# Altium schematic sheet SP26_FindingTitan_PWr & GND_Michael_Krueger.SchDoc
size A; SheetNumber: 1; SheetTotal: 6
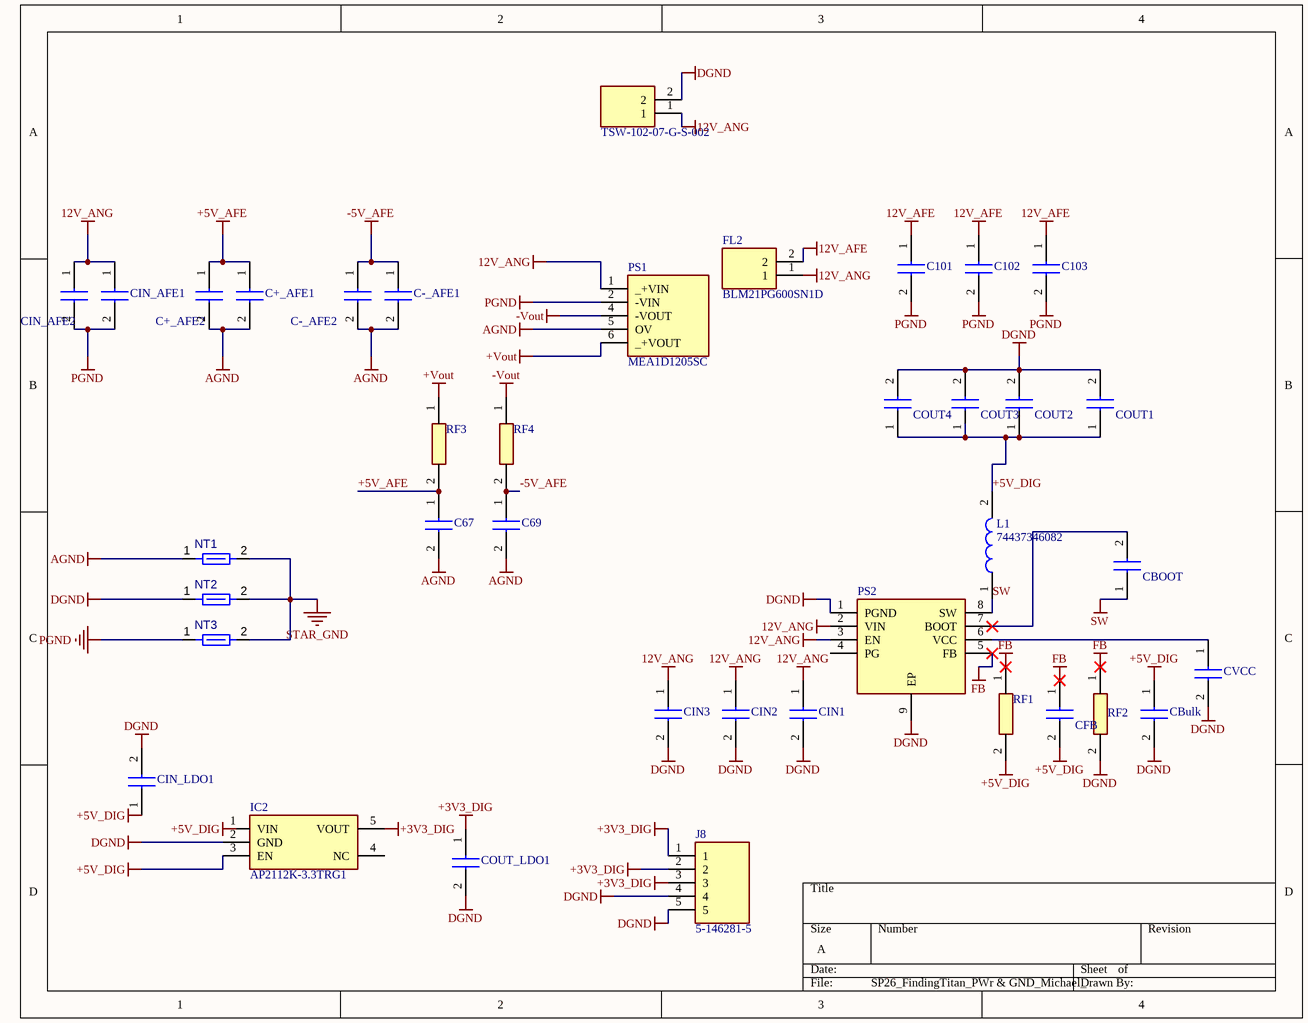
[diagram p0: SP26_FindingTitan_PWr & GND_Michael_Krueger.SchDoc]

## Parts
C67  GRM21BR71H105KA12L  [CAPC2012X145N]  (value not drawn)
C69  GRM21BR71H105KA12L  [CAPC2012X145N]  (value not drawn)
C101  GRM21BR71H104KA01L  [CAPC2012X145N]  (value not drawn)
C102  CL10B224KB8NNNC  [CAPC1608X90N]  (value not drawn)
C103  GRM32ER71H106KA12L  [CAPC3225X270N]  (value not drawn)
C+_AFE1  C1206C104K4RACTU  [C1206]  (value not drawn)
C+_AFE2  C3216X7R1H106K160AC  [CAPC3216X180N]  (value not drawn)
C-_AFE1  C1206C104K4RACTU  [C1206]  (value not drawn)
C-_AFE2  C3216X7R1H106K160AC  [CAPC3216X180N]  (value not drawn)
CBOOT  GRM188R71H104KA93D  [CAPC1608X90N]  (value not drawn)
CBulk  CL21A476MQYNNNE  [CAPC2012X135N]  (value not drawn)
CFB  GRM1555C1H220JA01D  [CAPC1005X70N]  (value not drawn)
CIN1  GRM32ER71H106KA12L  [CAPC3225X270N]  (value not drawn)
CIN2  CL10B224KB8NNNC  [CAPC1608X90N]  (value not drawn)
CIN3  GRM21BR71H104KA01L  [CAPC2012X145N]  (value not drawn)
CIN_AFE1  C1206C104K4RACTU  [C1206]  (value not drawn)
CIN_AFE2  C3216X7R1H106K160AC  [CAPC3216X180N]  (value not drawn)
CIN_LDO1  GRM31CR71A475KA01L  [CAPC3216X180N]  (value not drawn)
COUT1  GRM21BR61A226ME44K  [GRM21BR60J226ME39L]  (value not drawn)
COUT2  GRM21BR61A226ME44K  [GRM21BR60J226ME39L]  (value not drawn)
COUT3  GRM21BR61A226ME44K  [GRM21BR60J226ME39L]  (value not drawn)
COUT4  GRM21BR61A226ME44K  [GRM21BR60J226ME39L]  (value not drawn)
COUT_LDO1  GRM31CR71A475KA01L  [CAPC3216X180N]  (value not drawn)
CVCC  GRM188R61A105KA61D  [CAPC1608X90N]  (value not drawn)
FL2  BLM21PG600SN1D  [BLM21AG102BH1J]
IC2  AP2112K-3.3TRG1  [SOT95P285X140-5N]
J8  5-146281-5  [HDRV5W67P0X254_1X5_1229X234X821P]
J?  TSW-102-07-G-S-002  [HDRV2W64P0X254_1X2_508X254X838P]
L1  74437346082  [WE-LHMI_7030/705048]
NT1  Net Tie 0.6x1.4mm  [SHORT10_8MIL-FP]  (value not drawn)  (net tie, no BOM)
NT2  Net Tie 0.6x1.4mm  [SHORT10_8MIL-FP]  (value not drawn)  (net tie, no BOM)
NT3  Net Tie 0.6x1.4mm  [SHORT10_8MIL-FP]  (value not drawn)  (net tie, no BOM)
PS1  MEA1D1205SC  [MEA1D1205SC]
PS2  LMR33630ADDA  [SOIC127P600X170-9N]  (value not drawn)
RF1  CRCW0805100KFKEAHP  [RESC2012X60N]  (value not drawn)
RF2  CRCW080524K9FKEA  [RESC2012X50N]  (value not drawn)
RF3  CRCW0805100KFKEAHP  [RESC2012X60N]  (value not drawn)
RF4  CRCW0805100KFKEAHP  [RESC2012X60N]  (value not drawn)

## Nets
12V_AFE: C101.1 C102.1 C103.1 FL2.2
12V_ANG: CIN1.1 CIN2.1 CIN3.1 CIN_AFE1.1 CIN_AFE2.1 FL2.1 J?.1 PS1.1(_+VIN) PS2.2(VIN) PS2.3(EN)
+3V3_DIG: COUT_LDO1.1 IC2.5(VOUT) J8.1 J8.2 J8.3
+5V_AFE: C67.1 C+_AFE1.1 C+_AFE2.1 RF3.2
+5V_DIG: CBulk.1 CFB.2 CIN_LDO1.1 COUT1.1 COUT2.1 COUT3.1 COUT4.1 IC2.3(EN) L1.2 RF1.2
+Vout: PS1.6(_+VOUT) RF3.1
-5V_AFE: C69.1 C-_AFE1.1 C-_AFE2.1 RF4.2
-Vout: PS1.4(-VOUT) RF4.1
AGND: C67.2 C69.2 C+_AFE1.2 C+_AFE2.2 C-_AFE1.2 C-_AFE2.2 NT1.1 PS1.5(OV)
DGND: CBulk.2 CIN1.2 CIN2.2 CIN3.2 CIN_LDO1.2 COUT1.2 COUT2.2 COUT3.2 COUT4.2 COUT_LDO1.2 CVCC.2 IC2.2(GND) J8.4 J8.5 J?.2 NT2.1 PS2.1(PGND) PS2.9(EP) RF2.2
FB: CFB.1 PS2.5(FB) RF1.1 RF2.1
PGND: C101.2 C102.2 C103.2 CIN_AFE1.2 CIN_AFE2.2 NT3.1 PS1.2(-VIN)
STAR_GND: NT1.2 NT2.2 NT3.2
SW: CBOOT.1 L1.1 PS2.8(SW)
NetCBOOT_2: CBOOT.2 PS2.7(BOOT)
NetCVCC_1: CVCC.1 PS2.6(VCC)

Not connected (* = marked no-connect by the designer): IC2 1(VIN) 4(NC); PS2 4(PG)

## Notes on the sheet
- Labels drawn without touching a wire or pin: +5V_DIG

## Library data of the parts
C67 C69 = GRM21BR71H105KA12L: Capacitor; Manufacturer_Name: Murata Electronics; Datasheet Link: https://search.murata.co.jp/Ceramy/image/img/A01X/G101/ENG/GRM21BR71H105KA12-01.pdf; Height: 1.45mm; Manufacturer_Part_Number: GRM21BR71H105KA12L; Mouser Part Number: 81-GRM21BR71H105KA2L; Mouser Price/Stock: https://www.mouser.co.uk/ProductDetail/Murata-Electronics/GRM21BR71H105KA12L?qs=Er06SXQpt%252B60EIT%2FJ7%2F41Q%3D%3D; Arrow Part Number: GRM21BR71H105KA12L; Arrow Price/Stock: https://www.arrow.com/en/products/grm21br71h105ka12l/murata-manufacturing?utm_currency=USD&region=europe
C101 CIN3 = GRM21BR71H104KA01L: Capacitor; Manufacturer_Name: Murata Electronics; Datasheet Link: https://search.murata.co.jp/Ceramy/image/img/A01X/G101/ENG/GRM21BR71H104KA01-01.pdf; Height: 1.45mm; Manufacturer_Part_Number: GRM21BR71H104KA01L; Mouser Part Number: 81-GRM40X104K50L; Mouser Price/Stock: https://www.mouser.co.uk/ProductDetail/Murata-Electronics/GRM21BR71H104KA01L?qs=JovLnzPPZAL81o2XNDa%2FDA%3D%3D; Arrow Part Number: GRM21BR71H104KA01L; Arrow Price/Stock: https://www.arrow.com/en/products/grm21br71h104ka01l/murata-manufacturing?utm_currency=USD&region=europe
C102 CIN2 = CL10B224KB8NNNC: Capacitor; Manufacturer_Name: SAMSUNG; Datasheet Link: https://datasheet.pas.partquest.com/images/VipMasterIC/IC/SEMS/SEMS-S-A0008520096/SEMS-S-A0008520031-1.pdf?hkey=EF798316E3902B6ED9A73243A3159BB0; Height: 0.9mm; Manufacturer_Part_Number: CL10B224KB8NNNC; Mouser Part Number: 187-CL10B224KB8NNNC; Mouser Price/Stock: https://www.mouser.co.uk/ProductDetail/Samsung-Electro-Mechanics/CL10B224KB8NNNC?qs=wk8hpYEhAtJXV8UU0vulXQ%3D%3D; Arrow Part Number: CL10B224KB8NNNC; Arrow Price/Stock: https://www.arrow.com/en/products/cl10b224kb8nnnc/samsung-electro-mechanics
C103 CIN1 = GRM32ER71H106KA12L: Capacitor; Manufacturer_Name: Murata Electronics; Datasheet Link: https://pim.murata.com/asset/pim4/ceramicCapacitorSMD/SMD-EN_PDF_CERAMICCAPACITORSMD; Height: 2.7mm; Manufacturer_Part_Number: GRM32ER71H106KA12L; Mouser Part Number: 81-GRM32ER71H106KA2L; Mouser Price/Stock: https://www.mouser.co.uk/ProductDetail/Murata-Electronics/GRM32ER71H106KA12L?qs=6pxx44s1bjkjdm74o%2FrKhg%3D%3D; Arrow Part Number: GRM32ER71H106KA12L; Arrow Price/Stock: https://www.arrow.com/en/products/grm32er71h106ka12l/murata-manufacturing?utm_currency=USD&region=europe
C+_AFE1 C-_AFE1 CIN_AFE1 = C1206C104K4RACTU: Capacitor; Manufacturer_Name: KEMET; Datasheet Link: https://content.kemet.com/datasheets/KEM_C1002_X7R_SMD.pdf; Manufacturer_Part_Number: C1206C104K4RACTU; Mouser Part Number: 80-C1206C104K4R; Mouser Price/Stock: https://www.mouser.co.uk/ProductDetail/KEMET/C1206C104K4RACTU?qs=NAOyRStS94fKvqJx0gg6JQ%3D%3D; Arrow Part Number: C1206C104K4RACTU; Arrow Price/Stock: https://www.arrow.com/en/products/c1206c104k4ractu/kemet-corporation
C+_AFE2 C-_AFE2 CIN_AFE2 = C3216X7R1H106K160AC: Capacitor; Manufacturer_Name: TDK; Datasheet Link: https://product.tdk.com/info/en/catalog/datasheets/mlcc_commercial_midvoltage_en.pdf; Height: 1.8mm; Manufacturer_Part_Number: C3216X7R1H106K160AC; Mouser Part Number: 810-C3216X7R1HK160AC; Mouser Price/Stock: https://www.mouser.co.uk/ProductDetail/TDK/C3216X7R1H106K160AC?qs=gZXFycFWdAOhQ%2F%252B4feavtA%3D%3D; Arrow Part Number: C3216X7R1H106K160AC; Arrow Price/Stock: https://www.arrow.com/en/products/c3216x7r1h106k160ac/tdk?utm_currency=USD&region=europe
CBOOT = GRM188R71H104KA93D: Capacitor; Manufacturer_Name: Murata Electronics; Datasheet Link: https://datasheet.datasheetarchive.com/originals/distributors/Datasheets_SAMA/ec4f1577dddcc7a13ddad897a28002d3.pdf; Height: 0.9mm; Manufacturer_Part_Number: GRM188R71H104KA93D; Mouser Part Number: 81-GRM39X104K50D; Mouser Price/Stock: https://www.mouser.co.uk/ProductDetail/Murata-Electronics/GRM188R71H104KA93D?qs=f7ZljCwbPOm85Y6l%2FNGt7A%3D%3D; Arrow Part Number: GRM188R71H104KA93D; Arrow Price/Stock: https://www.arrow.com/en/products/grm188r71h104ka93d/murata-manufacturing?utm_currency=USD&region=europe
CBulk = CL21A476MQYNNNE: Capacitor; Manufacturer_Name: SAMSUNG; Datasheet Link: https://media.digikey.com/pdf/Data%20Sheets/Samsung%20PDFs/CL_Series_MLCC_ds.pdf; Height: 1.35mm; Manufacturer_Part_Number: CL21A476MQYNNNE; Mouser Part Number: 187-CL21A476MQYNNNE; Mouser Price/Stock: https://www.mouser.co.uk/ProductDetail/Samsung-Electro-Mechanics/CL21A476MQYNNNE?qs=yOVawPpwOwkBQMdcEdF9JA%3D%3D; Arrow Part Number: CL21A476MQYNNNE; Arrow Price/Stock: https://www.arrow.com/en/products/cl21a476mqynnne/samsung-electro-mechanics?region=nac
CFB = GRM1555C1H220JA01D: Capacitor; Manufacturer_Name: Murata Electronics; Datasheet Link: https://search.murata.co.jp/Ceramy/image/img/A01X/G101/ENG/GRM1555C1H220JA01-01A.pdf; Height: 0.7mm; Manufacturer_Part_Number: GRM1555C1H220JA01D; Mouser Part Number: 81-GRM1555C1H220JA1D; Mouser Price/Stock: https://www.mouser.co.uk/ProductDetail/Murata-Electronics/GRM1555C1H220JA01D?qs=4k9rjS6ZRl6sPwaL%252BE1uDQ%3D%3D; Arrow Part Number: GRM1555C1H220JA01D; Arrow Price/Stock: https://www.arrow.com/en/products/grm1555c1h220ja01d/murata-manufacturing?utm_currency=USD&region=nac
CIN_LDO1 COUT_LDO1 = GRM31CR71A475KA01L: Capacitor; Manufacturer_Name: Murata Electronics; Datasheet Link: https://search.murata.co.jp/Ceramy/image/img/A01X/G101/ENG/GRM31CR71A475KA01-01.pdf; Height: 1.8mm; Manufacturer_Part_Number: GRM31CR71A475KA01L; Mouser Part Number: 81-GRM426X475K10L; Mouser Price/Stock: https://www.mouser.com/Search/Refine.aspx?Keyword=81-GRM426X475K10L; Arrow Part Number: GRM31CR71A475KA01L; Arrow Price/Stock: https://www.arrow.com/en/products/grm31cr71a475ka01l/murata-manufacturing
COUT1-COUT4 = GRM21BR61A226ME44K: Capacitor; Manufacturer_Name: Murata Electronics; Datasheet Link: https://search.murata.co.jp/Ceramy/image/img/A01X/G101/ENG/GRM21BR61A226ME44-01A.pdf; Height: 1.45mm; Manufacturer_Part_Number: GRM21BR61A226ME44K; Mouser Part Number: 81-GRM21BR61A226ME4K; Mouser Price/Stock: https://www.mouser.co.uk/ProductDetail/Murata-Electronics/GRM21BR61A226ME44K?qs=hNud%2FORuBR0Fst3clGMQAg%3D%3D
CVCC = GRM188R61A105KA61D: Capacitor; Manufacturer_Name: Murata Electronics; Datasheet Link: https://search.murata.co.jp/Ceramy/image/img/A01X/G101/ENG/GRM188R61A105KA61-01A.pdf; Height: 0.9mm; Manufacturer_Part_Number: GRM188R61A105KA61D; Mouser Part Number: 81-GRM39R105K10; Mouser Price/Stock: https://www.mouser.co.uk/ProductDetail/Murata-Electronics/GRM188R61A105KA61D?qs=LlFn95tWfDgsujID1PD8Jw%3D%3D; Arrow Part Number: GRM188R61A105KA61D; Arrow Price/Stock: https://www.arrow.com/en/products/grm188r61a105ka61d/murata-manufacturing?utm_currency=USD&region=nac
FL2 = BLM21PG600SN1D: Filter; Manufacturer_Name: Murata Electronics; Datasheet Link: https://www.murata.com/en-us/products/productdetail?partno=BLM21PG600SN1%23; Height: 1.05mm; Manufacturer_Part_Number: BLM21PG600SN1D; Mouser Part Number: 81-BLM21P600S; Mouser Price/Stock: https://www.mouser.co.uk/ProductDetail/Murata-Electronics/BLM21PG600SN1D?qs=LbqjZSvnDswFXSg06XQ50A%3D%3D; Arrow Part Number: BLM21PG600SN1D; Arrow Price/Stock: https://www.arrow.com/en/products/blm21pg600sn1d/murata-manufacturing?utm_currency=USD&region=europe
IC2 = AP2112K-3.3TRG1: Integrated Circuit; Manufacturer_Name: Diodes Incorporated; Datasheet Link: https://www.diodes.com//assets/Datasheets/AP2112.pdf; Height: 1.4mm; Manufacturer_Part_Number: AP2112K-3.3TRG1; Mouser Part Number: 621-AP2112K-3.3TRG1; Mouser Price/Stock: https://www.mouser.co.uk/ProductDetail/Diodes-Incorporated/AP2112K-3.3TRG1?qs=x6A8l6qLYDDPYHosCdzh%2FA%3D%3D; Arrow Part Number: AP2112K-3.3TRG1; Arrow Price/Stock: https://www.arrow.com/en/products/ap2112k-3.3trg1/diodes-incorporated?utm_currency=USD&region=asia
J8 = 5-146281-5: Connector; Manufacturer_Name: TE Connectivity; Datasheet Link: https://www.te.com/commerce/DocumentDelivery/DDEController?Action=showdoc&DocId=Customer+Drawing%7F146281%7FG2%7Fpdf%7FEnglish%7FENG_CD_146281_G2.pdf%7F5-146281-5; Height: 8.21mm; Manufacturer_Part_Number: 5-146281-5; Mouser Part Number: 571-5-146281-5; Mouser Price/Stock: https://www.mouser.co.uk/ProductDetail/TE-Connectivity/5-146281-5?qs=bwpFY26eRVcDY9brDBVAcw%3D%3D; Arrow Part Number: 5-146281-5; Arrow Price/Stock: https://www.arrow.com/en/products/5-146281-5/te-connectivity?region=nac
J? = TSW-102-07-G-S-002: Connector; Manufacturer_Name: SAMTEC; Datasheet Link: http://suddendocs.samtec.com/prints/tsw-xxx-xx-xxx-x-xx-xxx-mkt.pdf; Height: 8.38mm; Manufacturer_Part_Number: TSW-102-07-G-S-002; Mouser Part Number: 200-TSW-10207GS002; Mouser Price/Stock: https://www.mouser.co.uk/ProductDetail/Samtec/TSW-102-07-G-S-002?qs=icabnvfcbsHvpvHCodBv1Q%3D%3D; Arrow Part Number: TSW-102-07-G-S-002; Arrow Price/Stock: https://www.arrow.com/en/products/tsw-102-07-g-s-002/samtec?utm_currency=USD&region=nac
L1 = 74437346082: Inductor; Manufacturer_Name: Wurth Elektronik; Datasheet Link: https://www.we-online.com/catalog/datasheet/74437346082.pdf; Height: 4.8mm; Manufacturer_Part_Number: 74437346082; Mouser Part Number: 710-74437346082; Mouser Price/Stock: https://www.mouser.co.uk/ProductDetail/Wurth-Elektronik/74437346082?qs=cFlH0mFHHFoREv9d7RQYtQ%3D%3D
NT1-NT3 = CMP-009-00120-2: Max Operating Temperature: 155°C; Min Operating Temperature: -55°C; Pins: 2
PS1 = MEA1D1205SC: Power Supply; Manufacturer_Name: Murata Electronics; Datasheet Link: http://power.murata.com/datasheet?/data/power/ncl/kdc_mea.pdf; Height: 10.25mm; Manufacturer_Part_Number: MEA1D1205SC; Mouser Part Number: 580-MEA1D1205SC; Mouser Price/Stock: https://www.mouser.co.uk/ProductDetail/Murata-Power-Solutions/MEA1D1205SC?qs=zbGHxLLsg8cZLauypDcKHA%3D%3D; Arrow Part Number: MEA1D1205SC; Arrow Price/Stock: https://www.arrow.com/en/products/mea1d1205sc/murata-power-solutions
PS2 = LMR33630ADDA: Power Supply; Manufacturer_Name: Texas Instruments; Datasheet Link: http://www.ti.com/lit/ds/symlink/lmr33630.pdf; Height: 1.7mm; Manufacturer_Part_Number: LMR33630ADDA; Mouser Part Number: 595-LMR33630ADDA; Mouser Price/Stock: https://www.mouser.co.uk/ProductDetail/Texas-Instruments/LMR33630ADDA?qs=r5DSvlrkXmL3yj62Sna%2FpQ%3D%3D; Arrow Part Number: LMR33630ADDA; Arrow Price/Stock: https://www.arrow.com/en/products/lmr33630adda/texas-instruments?utm_currency=USD&region=nac
RF1 RF3 RF4 = CRCW0805100KFKEAHP: Resistor; Manufacturer_Name: Vishay; Datasheet Link: https://componentsearchengine.com/Datasheets/1/CRCW08051R00FKEAHP.pdf; Height: 0.6mm; Manufacturer_Part_Number: CRCW0805100KFKEAHP; Mouser Part Number: 71-CRCW0805100KFKEAH; Mouser Price/Stock: https://www.mouser.co.uk/ProductDetail/Vishay-Dale/CRCW0805100KFKEAHP?qs=k2%2FDWSARqgFvzezk%252B9pwaw%3D%3D; Arrow Part Number: CRCW0805100KFKEAHP; Arrow Price/Stock: https://www.arrow.com/en/products/crcw0805100kfkeahp/vishay?utm_currency=USD&region=nac
RF2 = CRCW080524K9FKEA: Resistor; Manufacturer_Name: Vishay; Datasheet Link: http://www.vishay.com/docs/20035/dcrcwe3.pdf; Height: 0.5mm; Manufacturer_Part_Number: CRCW080524K9FKEA; Mouser Part Number: 71-CRCW0805-24.9K-E3; Mouser Price/Stock: https://www.mouser.co.uk/ProductDetail/Vishay-Dale/CRCW080524K9FKEA?qs=hdPY9BlFm%252BfjvoBJhmYH%252Bw%3D%3D; Arrow Part Number: CRCW080524K9FKEA; Arrow Price/Stock: https://www.arrow.com/en/products/crcw080524k9fkea/vishay